# Altium schematic sheet 9_Flow-Sensor.SchDoc
size A; SheetNumber: 9; SheetTotal: 11
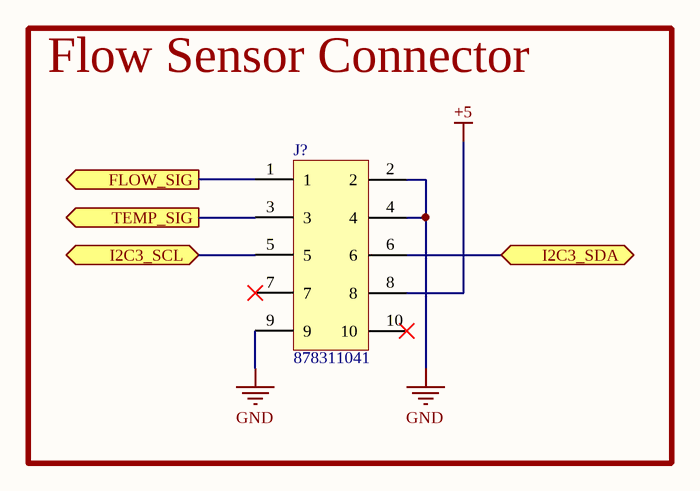
[diagram p0: 9_Flow-Sensor.SchDoc]

## Parts
J?  878311041  [878311041]

## Blocks framed on the sheet
Flow Sensor Connector: J?

## Ports
FLOW_SIG (out), I2C3_SCL (bidir, see 2_MCU-BLE[3C]), I2C3_SDA (bidir, see 2_MCU-BLE[3C]), TEMP_SIG (out)

## Nets
+5: J?.8
GND: J?.2 J?.4 J?.9
FLOW_SIG: J?.1 ; port FLOW_SIG
I2C3_SCL: J?.5 ; port I2C3_SCL
I2C3_SDA: J?.6 ; port I2C3_SDA
TEMP_SIG: J?.3 ; port TEMP_SIG

Not connected (* = marked no-connect by the designer): J? 7* 10*

## Library data of the parts
J? = MOLEX 10 POS 2mm TH: MFR: Molex; Value: DNS; MFR PN: 878311041